# Altium schematic sheet AVR8 RedBoard.SchDoc: AVR WINTER
size A4; Author: Tran Tuan; CompanyName: Vnelektronics Co.,Ltd; DrawnBy: Tran Tuan; Engineer: Tran Tuan; Organization: Vnelektronics Co.,Ltd; Address1: 776 Ton Duc Thang; Address2: Lien Chieu, Da Nang; Revision: 1.0; SheetNumber: 01; SheetTotal: 01; ProjectName: AVR Development kit
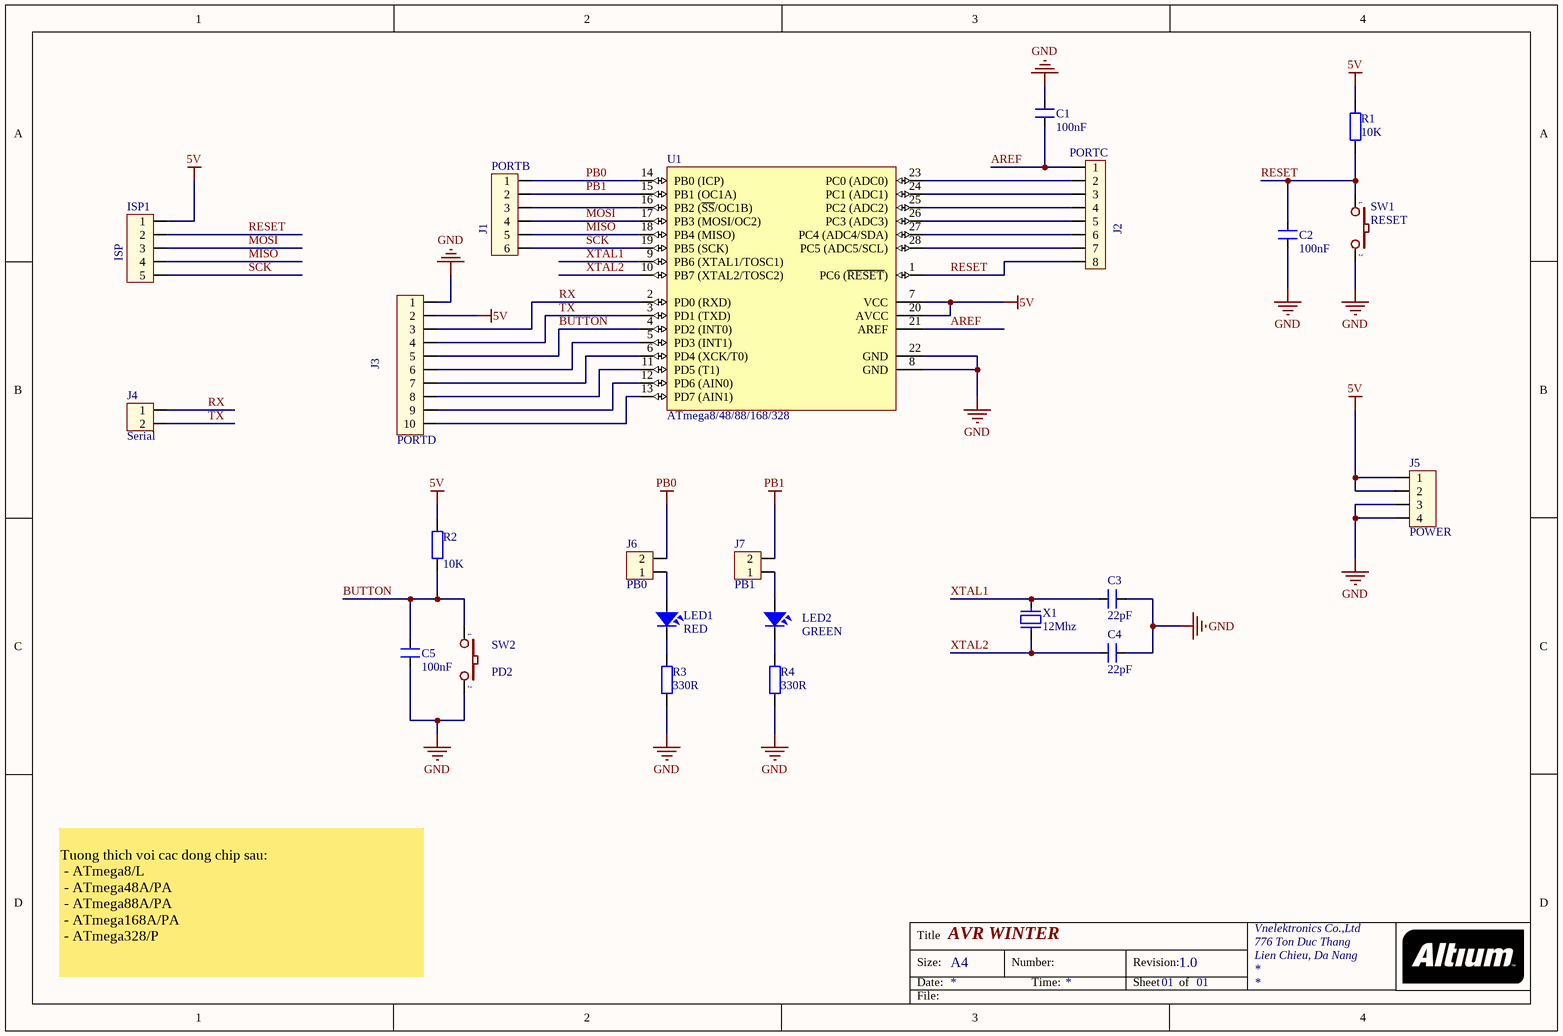
[diagram p0: AVR8 RedBoard.SchDoc]

## Parts
C1  100nF  [C0805]
C2  100nF  [C0805]
C3  22pF  [C0603]
C4  22pF  [C0603]
C5  100nF  [C0805]
ISP1  ISP  [Header_5]
J1  PORTB  [Header_6]
J2  PORTC  [Header_8]
J3  PORTD  [Header_10]
J4  Serial  [Header_2]
J5  POWER  [Header_4]
J6  PB0  [Header_2]
J7  PB1  [Header_2]
LED1  RED  [Led 0805R]
LED2  GREEN  [Led 0805G]
R1  value 10K  [RESC2012(0805)]  (hidden comment: Res2)
R2  value 10K  [RESC2012(0805)]  (hidden comment: Res2)
R3  value 330R  [RESC2012(0805)]  (hidden comment: Res2)
R4  value 330R  [RESC2012(0805)]  (hidden comment: Res2)
SW1  RESET  [BUTTON 2PIN TRON]
SW2  PD2  [BUTTON 2PIN TRON]
U1  ATmega8/48/88/168/328  [SOCKET_28]
X1  12Mhz  [CRYSTAL]

## Nets
5V: ISP1.1 J3.2 J5.1 J5.2 R1.2 R2.2 U1.7(VCC) U1.20(AVCC)
GND: C1.1 C2.2 C3.1 C4.1 C5.2 J3.1 J5.3 J5.4 R3.2 R4.2 SW1.2 SW2.2 U1.8(GND) U1.22(GND)
PB0: J1.1 J6.2 U1.14(PB0_(ICP))
PB1: J1.2 J7.2 U1.15(PB1_(OC1A))
AREF: C1.2 J2.1 U1.21(AREF)
BUTTON: C5.1 J3.5 R2.1 SW2.1 U1.4(PD2_(INT0))
MISO: ISP1.4 J1.5 U1.18(PB4_(MISO))
MOSI: ISP1.3 J1.4 U1.17(PB3_(MOSI/OC2))
RESET: C2.1 ISP1.2 J2.8 R1.1 SW1.1 U1.1(PC6_(~{RESET}))
RX: J3.3 J4.1 U1.2(PD0_(RXD))
SCK: ISP1.5 J1.6 U1.19(PB5_(SCK))
TX: J3.4 J4.2 U1.3(PD1_(TXD))
XTAL1: C3.2 U1.9(PB6_(XTAL1/TOSC1)) X1.1
XTAL2: C4.2 U1.10(PB7_(XTAL2/TOSC2)) X1.2
NetJ1_3: J1.3 U1.16(PB2_(~{SS}/OC1B))
NetJ2_2: J2.2 U1.23(PC0_(ADC0))
NetJ2_3: J2.3 U1.24(PC1_(ADC1))
NetJ2_4: J2.4 U1.25(PC2_(ADC2))
NetJ2_5: J2.5 U1.26(PC3_(ADC3))
NetJ2_6: J2.6 U1.27(PC4_(ADC4/SDA))
NetJ2_7: J2.7 U1.28(PC5_(ADC5/SCL))
NetJ3_6: J3.6 U1.5(PD3_(INT1))
NetJ3_7: J3.7 U1.6(PD4_(XCK/T0))
NetJ3_8: J3.8 U1.11(PD5_(T1))
NetJ3_9: J3.9 U1.12(PD6_(AIN0))
NetJ3_10: J3.10 U1.13(PD7_(AIN1))
NetJ6_1: J6.1 LED1.1
NetJ7_1: J7.1 LED2.1
NetLED1_2: LED1.2 R3.1
NetLED2_2: LED2.2 R4.1

## Notes on the sheet
- Tuong thich voi cac dong chip sau:
  - ATmega8/L
  - ATmega48A/PA
  - ATmega88A/PA
  - ATmega168A/PA
  - ATmega328/P
- Title
- Size:
- Date:
- A4
- Number:
- Time:
- Revision:
- Sheet
- of
- File:

## Library data of the parts
C1-C5 = CN1: Cap np  1pF - 472pF; Value: 100pF
ISP1 = Hed5: Header 5 (Green); Value: Header 5
J1 = Hed6: Header 6; Value: Header 5
J2 = Hed8: Hedear 8; Creat by: VanDungEvn@Gmail.com
J3 = Hed10: Header 10; Value: Header 5
J4 J6 J7 = Hed2: Header 2 (Green); Value: Header 2
J5 = Hed4: Header 4 (Green); Value: Header 4
LED1 LED2 = LED: LED Single colour Green and Red; Value: LED 3 ly Single Colour
R1-R4 = Res2: Resistor; Published: 8-Jun-2000; LatestRevisionDate: 17-Jul-2002; LatestRevisionNote: Re-released for DXP Platform.; PackageReference: AXIAL-0.4; Publisher: Altium Limited; PackageDescription: Axial Device, Thru-Hole; 2 Leads; 0.4 in Pin Spacing
SW1 SW2 = SW2: Switch button 2 pin; Value: SW chip 2 pin
U1 = ATmega8-L: 8-Bit AVR Microcontroller with 8K Bytes of In-System Programmable Flash Memory; Value: ATmega8-L
X1 = XT2: Crystal For all Crystal 2pin.; Value: 4Mhz